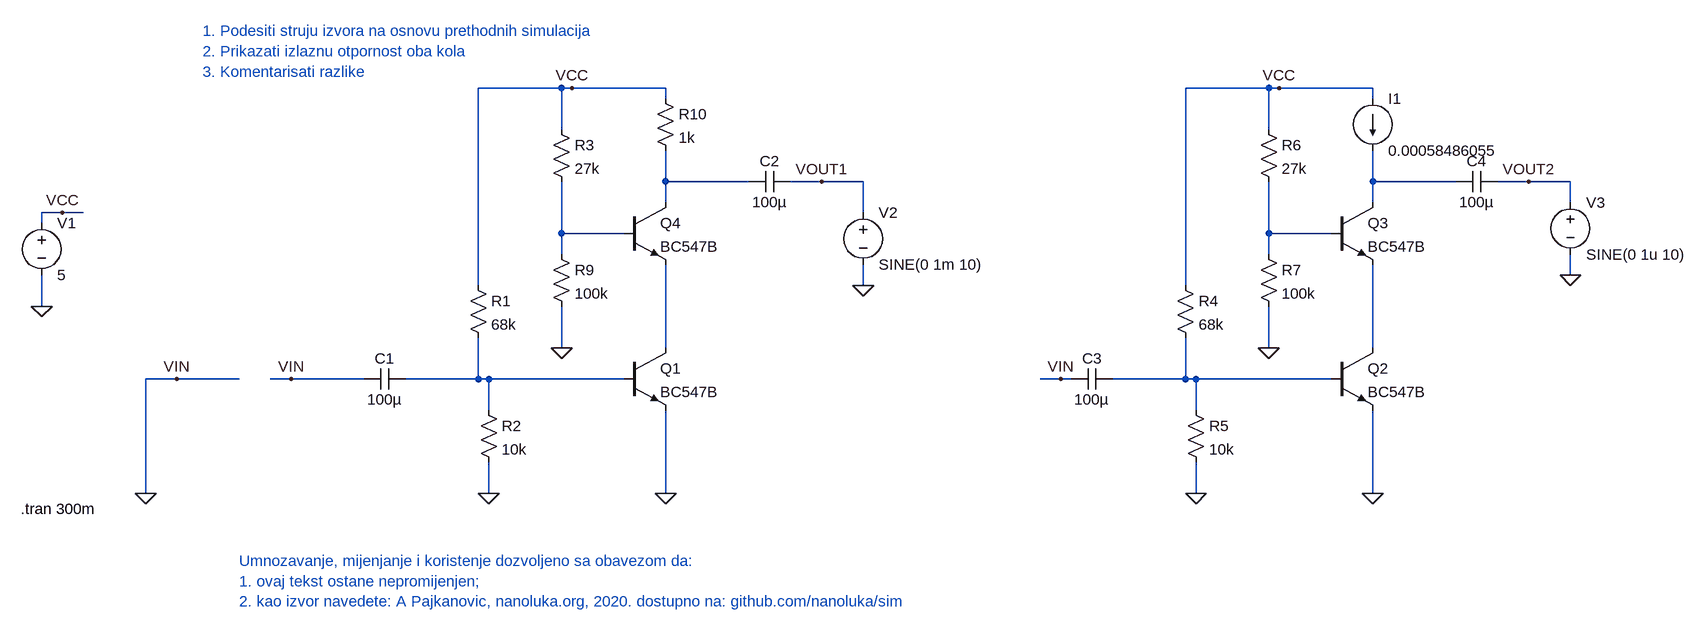
[diagram p0: schematic 05_izlaznaOtpornost_KSK.asc]
05_izlaznaOtpornost_KSK.asc, the LTspice schematic file:
Version 4
SHEET 1 1928 680
WIRE 192 -320 64 -320
WIRE 208 -320 192 -320
WIRE 352 -320 208 -320
WIRE 1280 -320 1152 -320
WIRE 1296 -320 1280 -320
WIRE 1440 -320 1296 -320
WIRE 352 -304 352 -320
WIRE 1440 -304 1440 -320
WIRE 192 -256 192 -320
WIRE 1280 -256 1280 -320
WIRE 352 -176 352 -224
WIRE 480 -176 352 -176
WIRE 592 -176 544 -176
WIRE 656 -176 592 -176
WIRE 1440 -176 1440 -224
WIRE 1568 -176 1440 -176
WIRE 1680 -176 1632 -176
WIRE 1744 -176 1680 -176
WIRE 352 -144 352 -176
WIRE 1440 -144 1440 -176
WIRE 1744 -144 1744 -176
WIRE -576 -128 -608 -128
WIRE -544 -128 -576 -128
WIRE 656 -128 656 -176
WIRE -608 -112 -608 -128
WIRE 192 -96 192 -176
WIRE 288 -96 192 -96
WIRE 1280 -96 1280 -176
WIRE 1376 -96 1280 -96
WIRE 192 -64 192 -96
WIRE 1280 -64 1280 -96
WIRE 1744 -32 1744 -64
WIRE 64 -16 64 -320
WIRE 656 -16 656 -48
WIRE 1152 -16 1152 -320
WIRE -608 16 -608 -32
WIRE 192 80 192 16
WIRE 352 80 352 -48
WIRE 1280 80 1280 16
WIRE 1440 80 1440 -48
WIRE -400 128 -448 128
WIRE -304 128 -400 128
WIRE -224 128 -256 128
WIRE -112 128 -224 128
WIRE 64 128 64 64
WIRE 64 128 -48 128
WIRE 80 128 64 128
WIRE 288 128 80 128
WIRE 960 128 928 128
WIRE 976 128 960 128
WIRE 1152 128 1152 64
WIRE 1152 128 1040 128
WIRE 1168 128 1152 128
WIRE 1376 128 1168 128
WIRE 80 176 80 128
WIRE 1168 176 1168 128
WIRE -448 304 -448 128
WIRE 80 304 80 256
WIRE 352 304 352 176
WIRE 1168 304 1168 256
WIRE 1440 304 1440 176
FLAG -608 16 0
FLAG -448 304 0
FLAG -576 -128 VCC
FLAG -400 128 VIN
FLAG 1168 304 0
FLAG 1440 304 0
FLAG 1296 -320 VCC
FLAG 1680 -176 VOUT2
FLAG 960 128 VIN
FLAG 1280 80 0
FLAG 80 304 0
FLAG 352 304 0
FLAG 208 -320 VCC
FLAG 592 -176 VOUT1
FLAG -224 128 VIN
FLAG 192 80 0
FLAG 656 -16 0
FLAG 1744 -32 0
DATAFLAG 1312 -96 ""
DATAFLAG 1504 -176 ""
DATAFLAG 224 -96 ""
DATAFLAG 416 -176 ""
SYMBOL voltage -608 -128 R0
WINDOW 123 0 0 Left 2
WINDOW 39 0 0 Left 2
SYMATTR InstName V1
SYMATTR Value 5
SYMBOL res 1136 -32 R0
SYMATTR InstName R4
SYMATTR Value 68k
SYMBOL res 1152 160 R0
SYMATTR InstName R5
SYMATTR Value 10k
SYMBOL npn 1376 80 R0
SYMATTR InstName Q2
SYMATTR Value BC547B
SYMBOL cap 1040 112 R90
WINDOW 0 0 32 VBottom 2
WINDOW 3 32 32 VTop 2
SYMATTR InstName C3
SYMATTR Value 100µ
SYMBOL cap 1632 -192 R90
WINDOW 0 0 32 VBottom 2
WINDOW 3 32 32 VTop 2
SYMATTR InstName C4
SYMATTR Value 100µ
SYMBOL npn 1376 -144 R0
SYMATTR InstName Q3
SYMATTR Value BC547B
SYMBOL res 1264 -272 R0
SYMATTR InstName R6
SYMATTR Value 27k
SYMBOL res 1264 -80 R0
SYMATTR InstName R7
SYMATTR Value 100k
SYMBOL res 48 -32 R0
SYMATTR InstName R1
SYMATTR Value 68k
SYMBOL res 64 160 R0
SYMATTR InstName R2
SYMATTR Value 10k
SYMBOL npn 288 80 R0
SYMATTR InstName Q1
SYMATTR Value BC547B
SYMBOL cap -48 112 R90
WINDOW 0 0 32 VBottom 2
WINDOW 3 32 32 VTop 2
SYMATTR InstName C1
SYMATTR Value 100µ
SYMBOL cap 544 -192 R90
WINDOW 0 0 32 VBottom 2
WINDOW 3 32 32 VTop 2
SYMATTR InstName C2
SYMATTR Value 100µ
SYMBOL npn 288 -144 R0
SYMATTR InstName Q4
SYMATTR Value BC547B
SYMBOL res 176 -272 R0
SYMATTR InstName R3
SYMATTR Value 27k
SYMBOL res 176 -80 R0
SYMATTR InstName R9
SYMATTR Value 100k
SYMBOL res 336 -320 R0
SYMATTR InstName R10
SYMATTR Value 1k
SYMBOL current 1440 -304 R0
WINDOW 123 0 0 Left 2
WINDOW 39 24 28 Left 2
SYMATTR InstName I1
SYMATTR Value 0.00058486055
SYMBOL voltage 656 -144 R0
WINDOW 123 0 0 Left 2
WINDOW 39 0 0 Left 2
SYMATTR InstName V2
SYMATTR Value SINE(0 1m 10)
SYMBOL voltage 1744 -160 R0
WINDOW 123 0 0 Left 2
WINDOW 39 0 0 Left 2
SYMATTR InstName V3
SYMATTR Value SINE(0 1u 10)
TEXT -640 328 Left 2 !.tran 300m
TEXT -360 -408 Left 2 ;1. Podesiti struju izvora na osnovu prethodnih simulacija\n2. Prikazati izlaznu otpornost oba kola\n3. Komentarisati razlike
TEXT -304 408 Left 2 ;Umnozavanje, mijenjanje i koristenje dozvoljeno sa obavezom da:\n1. ovaj tekst ostane nepromijenjen;\n2. kao izvor navedete: A Pajkanovic, nanoluka.org, 2020. dostupno na: github.com/nanoluka/sim

The netlist it stands for:
* 05_izlaznaOtpornost_KSK.asc
V1 VCC 0 5
R4 VCC N008 68k
R5 N008 0 10k
Q2 N006 N008 0 0 BC547B
C3 N008 0 100µ
C4 VOUT2 N002 100µ
Q3 N002 N004 N006 0 BC547B
R6 VCC N004 27k
R7 N004 0 100k
R1 VCC N007 68k
R2 N007 0 10k
Q1 N005 N007 0 0 BC547B
C1 N007 0 100µ
C2 VOUT1 N001 100µ
Q4 N001 N003 N005 0 BC547B
R3 VCC N003 27k
R9 N003 0 100k
R10 VCC N001 1k
I1 VCC N002 0.00058486055
V2 VOUT1 0 SINE(0 1m 10)
V3 VOUT2 0 SINE(0 1u 10)
.model NPN NPN
.model PNP PNP
.lib standard.bjt
.tran 300m
* 1. Podesiti struju izvora na osnovu prethodnih simulacija
* 2. Prikazati izlaznu otpornost oba kola
* 3. Komentarisati razlike
* Umnozavanje, mijenjanje i koristenje dozvoljeno sa obavezom da:
* 1. ovaj tekst ostane nepromijenjen;
* 2. kao izvor navedete: A Pajkanovic, nanoluka.org, 2020. dostupno na: github.com/nanoluka/sim
.backanno
.end